# Altium schematic sheet Inputs2.SchDoc
size A4; SheetNumber: 4; SheetTotal: 4
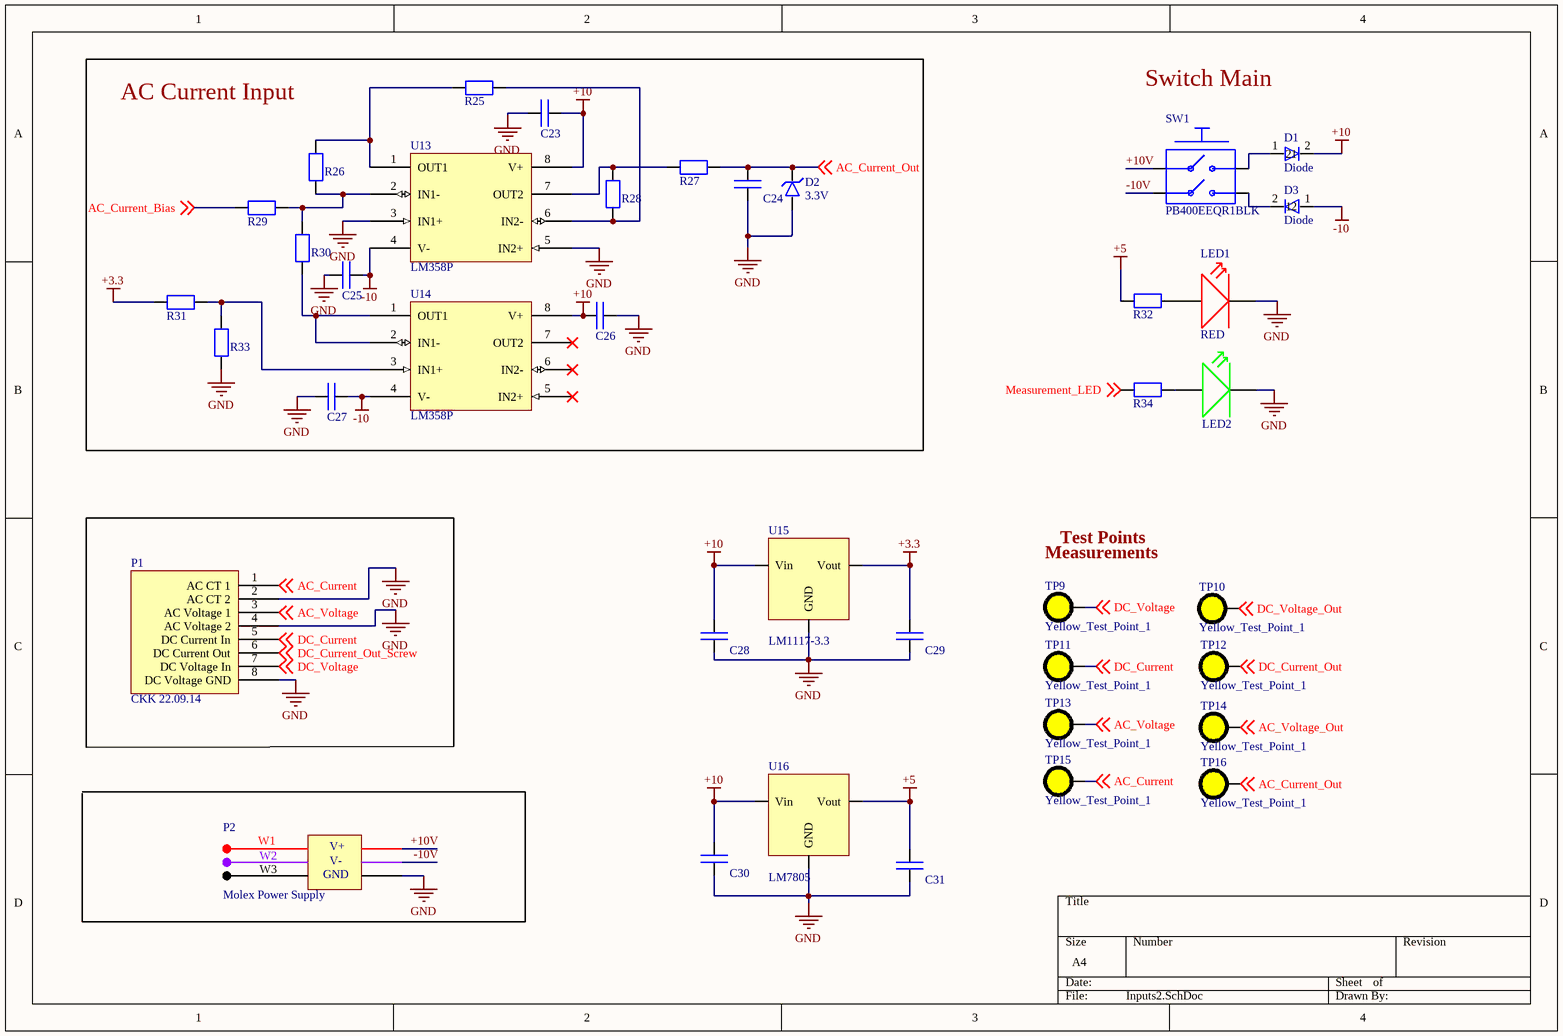
[diagram p0: Inputs2.SchDoc]

## Parts
C23  Capacitor  [Capacitor]  (value not drawn)
C24  Capacitor  [Capacitor]  (value not drawn)
C25  Capacitor  [Capacitor]  (value not drawn)
C26  Capacitor  [Capacitor]  (value not drawn)
C27  Capacitor  [Capacitor]  (value not drawn)
C28  Capacitor  [Capacitor]  (value not drawn)
C29  Capacitor  [Capacitor]  (value not drawn)
C30  Capacitor  [Capacitor]  (value not drawn)
C31  Capacitor  [Capacitor]  (value not drawn)
D1  Diode  [Diode]
D2  3.3V  [Zener Diode (3V)]
D3  Diode  [Diode]
LED1  RED  [LED]
LED2  Green  [LED]  (value not drawn)
P1  CKK 22.09.14  [Measurement_Socket]
P2  Molex Power Supply  [Molex_Power_Supply]
R25  Resistor  [Resistor]  (value not drawn)
R26  Resistor  [Resistor]  (value not drawn)
R27  Resistor  [Resistor]  (value not drawn)
R28  Resistor  [Resistor]  (value not drawn)
R29  Resistor  [Resistor]  (value not drawn)
R30  Resistor  [Resistor]  (value not drawn)
R31  Resistor  [Resistor]  (value not drawn)
R32  300o  [Resistor]  (value not drawn)
R33  Resistor  [Resistor]  (value not drawn)
R34  Resistor  [Resistor]  (value not drawn)
SW1  PB400EEQR1BLK  [PCBComponent_1 - duplicate]
TP9  Yellow_Test_Point_1  [TP]
TP10  Yellow_Test_Point_1  [TP]
TP11  Yellow_Test_Point_1  [TP]
TP12  Yellow_Test_Point_1  [TP]
TP13  Yellow_Test_Point_1  [TP]
TP14  Yellow_Test_Point_1  [TP]
TP15  Yellow_Test_Point_1  [TP]
TP16  Yellow_Test_Point_1  [TP]
U13  LM358P  [Op Amp]
U14  LM358P  [Op Amp]
U15  LM1117-3.3  [Voltge Regulator LM1117 (3.3)]
U16  LM7805  [Voltge Regulator LM7805 (5)]

## Blocks framed on the sheet
AC Current Input: C23-C27 D2 R25-R31 R33 U13 U14

## Nets
+3.3: C29.2 R31.1 U15.3(Vout)
+5: C31.2 R32.1 U16.3(Vout)
+10: C23.2 C26.1 C28.2 C30.2 D1.2 U13.8(V+) U14.8(V+) U15.1(Vin) U16.1(Vin)
-10: C25.2 C27.2 D3.1 U13.4(V-) U14.4(V-)
GND: C23.1 C24.1 C25.1 C26.2 C27.1 C28.1 C29.1 C30.1 C31.1 D2.1 LED1.2 LED2.2 P1.2(AC_CT_2) P1.4(AC_Voltage_2) P1.8(DC_Voltage_GND) P2.3 R33.1 U13.3(IN1+) U13.5(IN2+) U15.2(GND) U16.2(GND)
+10V: P2.1 SW1.1
-10V: P2.2 SW1.3
AC_Current: P1.1(AC_CT_1) TP15.1 ; off-sheet AC_Current
AC_Current_Bias: R29.1 ; off-sheet AC_Current_Bias
AC_Current_Out: C24.2 D2.2 R27.2 TP16.1 ; off-sheet AC_Current_Out
AC_Voltage: P1.3(AC_Voltage_1) TP13.1 ; off-sheet AC_Voltage
AC_Voltage_Out: TP14.1 ; off-sheet AC_Voltage_Out
DC_Current: P1.5(DC_Current_In) TP11.1 ; off-sheet DC_Current
DC_Current_Out: TP12.1 ; off-sheet DC_Current_Out
DC_Current_Out_Screw: P1.6(DC_Current_Out) ; off-sheet DC_Current_Out_Screw
DC_Voltage: P1.7(DC_Voltage_In) TP9.1 ; off-sheet DC_Voltage
DC_Voltage_Out: TP10.1 ; off-sheet DC_Voltage_Out
Measurement_LED: R34.1 ; off-sheet Measurement_LED
NetD1_1: D1.1 SW1.2
NetD3_2: D3.2 SW1.4
NetLED1_1: LED1.1 R32.2
NetLED2_1: LED2.1 R34.2
NetR25_1: R25.1 R26.2 U13.1(OUT1)
NetR25_2: R25.2 R28.1 U13.6(IN2-)
NetR26_1: R26.1 R29.2 R30.2 U13.2(IN1-)
NetR27_1: R27.1 R28.2 U13.7(OUT2)
NetR30_1: R30.1 U14.1(OUT1) U14.2(IN1-)
NetR31_2: R31.2 R33.2 U14.3(IN1+)

Not connected (* = marked no-connect by the designer): U14 5(IN2+)* 6(IN2-)* 7(OUT2)*

## Notes on the sheet
- Switch Main
- (near TP9) Measurements
- Test Points
- (in symbol Molex Power Supply) W1; V+; W2; V-; W3; GND

## Library data of the parts
D2 = Zener Diode
LED1 = RED_LED
LED2 = Green_LED
P1 = Measurement_Input_Terminal
R32 = Resistor
SW1 = PB400EEQR1BLK: Pushbutton Switch, DPST, Standard Through Hole, Right Angle, Off-On Function, 30V, Black; Manufacturer: E-Switch; Actuator Length: 10.4902mm; Contact Current Rating: 3A; Contact Resistance: 30mΩ; Electrical Life: 6kcycles; Insulation Resistance: 500MΩ; Number of Positions: 2; Operating Force: 7N; Supplier 1: DigiKey; Manufacturer Part Number: PB400EEQR1BLK; RoHS: Compliant; Category: Pushbutton Switches; Stock 1: 7960; Pricing 1: 1=2.09, 10=1.807, 25=1.7048, 50=1.6308, 100=1.56, 324=1.4466, 648=1.38355, 1296=1.32313 (USD); Contact Material: Silver; Export Control Classification Number (ECCN) Code: EAR99; Height: 10.2mm; Harmonized Tariff Schedule (HTS) Code: 8536.50.90.33; Introduction Date: 2017-12-19; Length: 11mm; Lifecycle Status: Production; Max Current Rating: 3A; Max Operating Temperature: 60°C; Max Voltage Rating (DC): 30V; Min Operating Temperature: -5°C; REACH SVHC: Yes; Throw Configuration: DPST; ComponentLink1URL: https://datasheet.octopart.com:443/PB400EEQR1BLK-E-Switch-datasheet-182202396.pdf?src-supplier=IHS; ComponentLink1Description: https://datasheet.octopart.com:443/PB400EEQR1BLK-E-Switch-datasheet-182202396.pdf?src-supplier=IHS; ComponentLink2URL: https://datasheet.octopart.com:443/PB400EEQR1BLK-E-Switch-datasheet-190233233.pdf?src-supplier=New+Yorker+Electronics; ComponentLink2Description: https://datasheet.octopart.com:443/PB400EEQR1BLK-E-Switch-datasheet-190233233.pdf?src-supplier=New+Yorker+Electronics; ComponentLink3URL: https://datasheet.octopart.com:443/PB400EEQR1BLK-E-Switch-datasheet-103039574.pdf?src-supplier=element14+APAC; ComponentLink3Description: https://datasheet.octopart.com:443/PB400EEQR1BLK-E-Switch-datasheet-103039574.pdf?src-supplier=element14+APAC; ComponentLink4URL: https://datasheet.octopart.com:443/PB400EEQR1BLK-E-Switch-datasheet-156105207.pdf?src-supplier=Future+Electronics; ComponentLink4Description: https://datasheet.octopart.com:443/PB400EEQR1BLK-E-Switch-datasheet-156105207.pdf?src-supplier=Future+Electronics; Supplier Part Number 1: EG5547-ND
U13 U14 = LM358P: Operational Amplifier, Dual, 700 Khz, 2, 0.4 V/ S, 1.5V To 16V, Dip, 8 Rohs Compliant: Yes; Manufacturer: Texas Instruments; Manufacturer Lifecycle Status: ACTIVE; Bandwidth: 1MHz; Common Mode Rejection Ratio: 65dB; Dual Supply Voltage: 9V; Gain Bandwidth Product: 700kHz; Input Bias Current: 250nA; Input Offset Voltage (Vos): 7mV; Max Supply Current: 700µA; Max Supply Voltage: 32V; Min Supply Voltage: 3V; Nominal Supply Current: 1.2mA; Number of Amplifiers: 2; Operating Supply Current: 1mA; Output Current: 30mA; Slew Rate: 0.3V/µs; Voltage Gain: 100dB; Supplier 1: DigiKey; Manufacturer Part Number: LM358P; RoHS: Compliant; Category: Amplifiers - Op Amps, Buffer, Instrumentation; Stock 1: 72654; Pricing 1: 1=0.27, 10=0.187, 50=0.153, 100=0.1423, 250=0.13104, 500=0.12426, 1000=0.11868, 2500=0.11278, 5000=0.1102 (USD); Case/Package: PDIP; Contact Plating: Gold; Height: 5.08mm; Lead Free: Lead Free; Length: 9.81mm; Lifecycle Status: Production; Max Dual Supply Voltage: 16V; Max Operating Temperature: 70°C; Min Dual Supply Voltage: 1.5V; Min Operating Temperature: 0°C; Mount: Through Hole; Number of Channels: 2; Number of Circuits: 2; Number of Elements: 2; Number of Pins: 8; Operating Supply Voltage: 16V; Output Current per Channel: 30mA; Power Supply Rejection Ratio (PSRR): 65dB; Radiation Hardening: No; REACH SVHC: No; Schedule B: 8542330000, 8542330000|8542330000|8542330000|8542330000|8542330000|8542330000|8542330000|8542330000|8542330000|8542330000|8542330000|8542330000|8542330000|8542330000|8542330000|8542330000|8542330000|8542330000|8542330000|8542330000|8542330000|8542330000|8542330000|85; Thickness: 3.9mm; Width: 6.35mm; ComponentLink1URL: https://datasheet.octopart.com:443/LM358P-Texas-Instruments-datasheet-22122189.pdf?src-supplier=Texas+Instruments; ComponentLink1Description: https://datasheet.octopart.com:443/LM358P-Texas-Instruments-datasheet-22122189.pdf?src-supplier=Texas+Instruments; ComponentLink2URL: https://octopart.com:443/opatz8j6/c1?t=oqAI8rLcFpUCwQz3XpiQyJu6cvQHEZqsQz-ajVCN9ANwwKTOsKfzA42PIMJelGWuzT3h6SD-c6fpyT0gSSX2jEno0skou8v9j3Jn_12a0HifiHKIe5xyb9D0ZmJu35xXUPkKHYTg9gNLLOZNL_ZRlu9lopCJkqKAh8-EcsD-mij-HCuIcf6e5wcGllE6vrwhH9FYTnOeC7BJcBEDEy-SR6Gf13-dAeqi_gwlv4VpfKxqzu3VdIKpO-63Eg9hZr4wxMFv42TwUYIo25Tt9ZzY3CMy4ptzf0nP6hbmpRkagDXPpxp0_YPC_pQDbKIScxns-zstyRPAOYYCKtuU7TPlFeKjWR049V7cUehsluTRxHTQ5ZZ8Ynx5nPbUd9yzTscO&src-supplier=Texas+Instruments; ComponentLink2Description: https://octopart.com:443/opatz8j6/c1?t=oqAI8rLcFpUCwQz3XpiQyJu6cvQHEZqsQz-ajVCN9ANwwKTOsKfzA42PIMJelGWuzT3h6SD-c6fpyT0gSSX2jEno0skou8v9j3Jn_12a0HifiHKIe5xyb9D0ZmJu35xXUPkKHYTg9gNLLOZNL_ZRlu9lopCJkqKAh8-EcsD-mij-HCuIcf6e5wcGllE6vrwhH9FYTnOeC7BJcBEDEy-SR6Gf13-dAeqi_gwlv4VpfKxqzu3VdIKpO-63Eg9hZr4wxMFv42TwUYIo25Tt9ZzY3CMy4ptzf0nP6hbmpRkagDXPpxp0_YPC_pQDbKIScxns-zstyRPAOYYCKtuU7TPlFeKjWR049V7cUehsluTRxHTQ5ZZ8Ynx5nPbUd9yzTscO&src-supplier=Texas+Instruments; ComponentLink3URL: https://sigma.octopart.com:443/49250158/technical_drawing/Texas-Instruments-LM358P.pdf?src-supplier=Texas+Instruments; ComponentLink3Description: https://sigma.octopart.com:443/49250158/technical_drawing/Texas-Instruments-LM358P.pdf?src-supplier=Texas+Instruments; ComponentLink4URL: https://datasheet.octopart.com:443/LM358P-Texas-Instruments-datasheet-149604.pdf?src-supplier=Upverter; ComponentLink4Description: https://datasheet.octopart.com:443/LM358P-Texas-Instruments-datasheet-149604.pdf?src-supplier=Upverter; ComponentLink5URL: https://datasheet.octopart.com:443/LM358P-Texas-Instruments-datasheet-16079558.pdf?src-supplier=Upverter; ComponentLink5Description: https://datasheet.octopart.com:443/LM358P-Texas-Instruments-datasheet-16079558.pdf?src-supplier=Upverter; ComponentLink6URL: https://datasheet.octopart.com:443/LM358P-Texas-Instruments-datasheet-81454335.pdf?src-supplier=Farnell; ComponentLink6Description: https://datasheet.octopart.com:443/LM358P-Texas-Instruments-datasheet-81454335.pdf?src-supplier=Farnell; ComponentLink7URL: https://datasheet.octopart.com:443/LM358P.-Texas-Instruments-datasheet-65712975.pdf?src-supplier=Farnell; ComponentLink7Description: https://datasheet.octopart.com:443/LM358P.-Texas-Instruments-datasheet-65712975.pdf?src-supplier=Farnell; ComponentLink8URL: https://datasheet.octopart.com:443/LM358P.-Texas-Instruments-datasheet-32750560.pdf?src-supplier=Farnell; ComponentLink8Description: https://datasheet.octopart.com:443/LM358P.-Texas-Instruments-datasheet-32750560.pdf?src-supplier=Farnell; ComponentLink9URL: https://datasheet.octopart.com:443/LM358P-Texas-Instruments-datasheet-10672735.pdf?src-supplier=Farnell; ComponentLink9Description: https://datasheet.octopart.com:443/LM358P-Texas-Instruments-datasheet-10672735.pdf?src-supplier=Farnell; ComponentLink10URL: https://datasheet.octopart.com:443/LM358P..-Texas-Instruments-datasheet-36780029.pdf?src-supplier=element14+APAC; ComponentLink10Description: https://datasheet.octopart.com:443/LM358P..-Texas-Instruments-datasheet-36780029.pdf?src-supplier=element14+APAC; ComponentLink11URL: https://datasheet.octopart.com:443/LM358P-Texas-Instruments-datasheet-2970.pdf?src-supplier=DigiKey; ComponentLink11Description: https://datasheet.octopart.com:443/LM358P-Texas-Instruments-datasheet-2970.pdf?src-supplier=DigiKey; ComponentLink12URL: https://datasheet.octopart.com:443/LM358P-Texas-Instruments-datasheet-159115118.pdf?src-supplier=LCSC; ComponentLink12Description: https://datasheet.octopart.com:443/LM358P-Texas-Instruments-datasheet-159115118.pdf?src-supplier=LCSC; ComponentLink13URL: https://datasheet.octopart.com:443/LM358P-Texas-Instruments-datasheet-147835639.pdf?src-supplier=SHENGYU+ELECTRONICS; ComponentLink13Description: https://datasheet.octopart.com:443/LM358P-Texas-Instruments-datasheet-147835639.pdf?src-supplier=SHENGYU+ELECTRONICS; ComponentLink14URL: https://datasheet.octopart.com:443/LM358P-Texas-Instruments-datasheet-101363746.pdf?src-supplier=Megastar; ComponentLink14Description: https://datasheet.octopart.com:443/LM358P-Texas-Instruments-datasheet-101363746.pdf?src-supplier=Megastar; ComponentLink15URL: https://datasheet.octopart.com:443/LM358P-Texas-Instruments-datasheet-137316104.pdf?src-supplier=Future+Electronics; ComponentLink15Description: https://datasheet.octopart.com:443/LM358P-Texas-Instruments-datasheet-137316104.pdf?src-supplier=Future+Electronics; ComponentLink16URL: https://datasheet.octopart.com:443/LM358P-Texas-Instruments-datasheet-21220556.pdf?src-supplier=Newark; ComponentLink16Description: https://datasheet.octopart.com:443/LM358P-Texas-Instruments-datasheet-21220556.pdf?src-supplier=Newark; ComponentLink17URL: https://datasheet.octopart.com:443/LM358P-Texas-Instruments-datasheet-14137277.pdf?src-supplier=iiiC; ComponentLink17Description: https://datasheet.octopart.com:443/LM358P-Texas-Instruments-datasheet-14137277.pdf?src-supplier=iiiC; ComponentLink18URL: https://datasheet.octopart.com:443/LM358P-Texas-Instruments-datasheet-10086281.pdf?src-supplier=element14; ComponentLink18Description: https://datasheet.octopart.com:443/LM358P-Texas-Instruments-datasheet-10086281.pdf?src-supplier=element14; ComponentLink19URL: https://datasheet.octopart.com:443/LM358P-Texas-Instruments-datasheet-8861238.pdf?src-supplier=element14; ComponentLink19Description: https://datasheet.octopart.com:443/LM358P-Texas-Instruments-datasheet-8861238.pdf?src-supplier=element14; ComponentLink20URL: https://datasheet.octopart.com:443/LM358P-Texas-Instruments-datasheet-8728431.pdf?src-supplier=element14; ComponentLink20Description: https://datasheet.octopart.com:443/LM358P-Texas-Instruments-datasheet-8728431.pdf?src-supplier=element14; ComponentLink21URL: https://datasheet.octopart.com:443/LM358P-Texas-Instruments-datasheet-8637033.pdf?src-supplier=element14; ComponentLink21Description: https://datasheet.octopart.com:443/LM358P-Texas-Instruments-datasheet-8637033.pdf?src-supplier=element14; ComponentLink22URL: https://datasheet.octopart.com:443/LM358P-Texas-Instruments-datasheet-17597669.pdf?src-supplier=TME; ComponentLink22Description: https://datasheet.octopart.com:443/LM358P-Texas-Instruments-datasheet-17597669.pdf?src-supplier=TME; ComponentLink23URL: https://datasheet.octopart.com:443/LM358P-Texas-Instruments-datasheet-8220297.pdf?src-supplier=Jameco; ComponentLink23Description: https://datasheet.octopart.com:443/LM358P-Texas-Instruments-datasheet-8220297.pdf?src-supplier=Jameco; ComponentLink24URL: https://datasheet.octopart.com:443/LM358P-Texas-Instruments-datasheet-111658.pdf?src-supplier=Sierra+IC; ComponentLink24Description: https://datasheet.octopart.com:443/LM358P-Texas-Instruments-datasheet-111658.pdf?src-supplier=Sierra+IC; ComponentLink25URL: http://sigma.octopart.com:80/reach_statement/Texas-Instruments-company-64.pdf?src-supplier=Compliance+Statements; ComponentLink25Description: http://sigma.octopart.com:80/reach_statement/Texas-Instruments-company-64.pdf?src-supplier=Compliance+Statements; ComponentLink26URL: http://sigma.octopart.com:80/conflict_mineral_statement/Texas-Instruments-company-63.pdf?src-supplier=Compliance+Statements; ComponentLink26Description: http://sigma.octopart.com:80/conflict_mineral_statement/Texas-Instruments-company-63.pdf?src-supplier=Compliance+Statements; Supplier Part Number 1: 296-1395-5-ND
U15 = 3.3V regulator
U16 = 5V Regulator